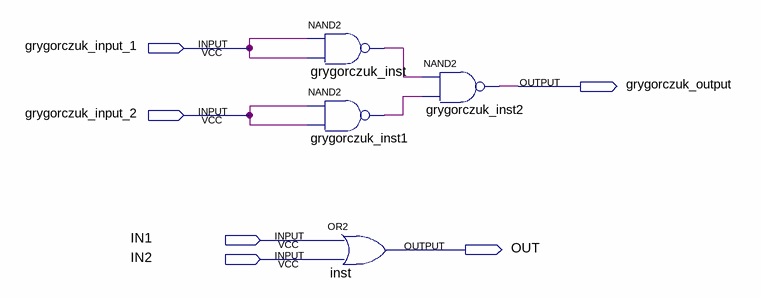
[diagram p0: schematic sheet]
// Quartus schematic OR_GATES.bdf as structural Verilog: 4 symbols, 6 pins
module OR_GATES (
  input  grygorczuk_input_1,
  input  grygorczuk_input_2,
  input  IN1,
  input  IN2,
  output grygorczuk_output,
  output OUT
);

  wire grygorczuk_inst1_out, grygorczuk_inst_out;

  nand grygorczuk_inst (grygorczuk_inst_out, grygorczuk_input_1, grygorczuk_input_1);
  nand grygorczuk_inst1 (grygorczuk_inst1_out, grygorczuk_input_2, grygorczuk_input_2);
  or inst (OUT, IN1, IN2);
  nand grygorczuk_inst2 (grygorczuk_output, grygorczuk_inst_out, grygorczuk_inst1_out);
endmodule
